# EAGLE design LPC1115_2TE_V1.04_I2C (EAGLE 7.2.0)
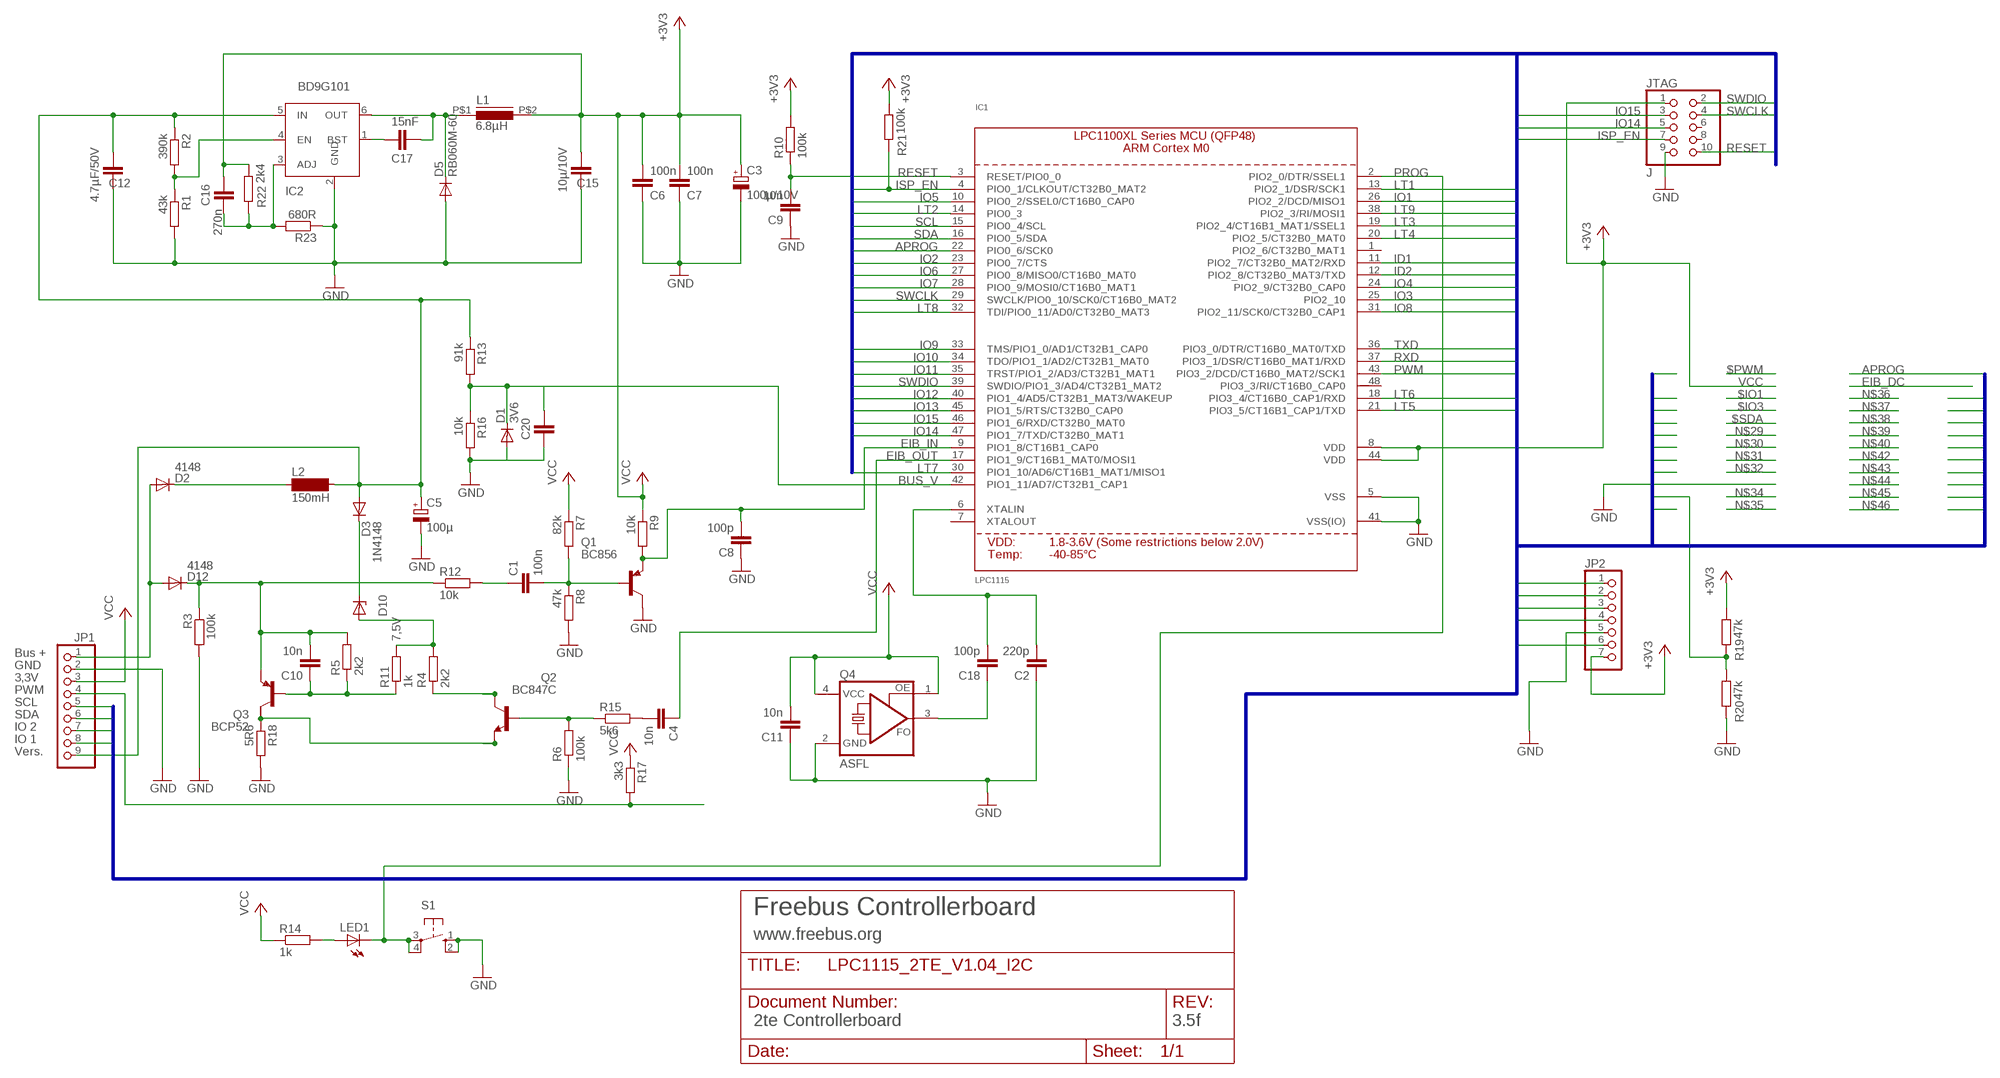
[diagram p0: schematic, sheet 1]

## Parts
C1  100n  C-EUC1206  [C1206]
C2  220p  C-EUC1206  [C1206]
C3  100µ/10V  CPOL-EUE2.5-5  [E2,5-5]
C4  10n  C-EUC1206  [C1206]
C5  100µ  CPOL-EUE3.5-8  [E3,5-8]
C6  100n  C-EUC1206  [C1206]
C7  100n  C-EUC1206  [C1206]
C8  100p  C-EUC1206K  [C1206K]
C9  10n  C-EUC1206K  [C1206K]
C10  10n  C-EUC1206  [C1206]
C11  10n  C-EUC1206  [C1206]
C12  4.7µF/50V  C-EUC1206K  [C1206K]
C15  10µ/10V  C-EUC1206K  [C1206K]
C16  270n  C-EUC1206  [C1206]
C17  15nF  C-EUC1206  [C1206]
C18  100p  C-EUC1206  [C1206]
C20  C-EUC1206  [C1206]
D1  3V6  DIODE-MINIMELF  [MINIMELF]
D2  4148  DIODE-MINIMELF  [MINIMELF]
D3  1N4148  DIODE-MINIMELF  [MINIMELF]
D5  RB060M-60  DIODE-SOD123  [SOD123]
D10  7,5V  ZPD  [MINIMELF]
D12  4148  DIODE-MINIMELF  [MINIMELF]
IC1  LPC1115  LPC1113/4/5_QFP48_XLSERIES  [LQFP48]
IC2  BD9G101  BD9G101GBD9G101G-SOT23-6  [SOT23-6]
JP1  PINHD-1X9  [1X09]
JP2  PINHD-1X7  [1X07]
JTAG  J  PINHD-2X05_2.00  [2X05M]
L1  6.8µH  IND_FASTRON_1616FPS  [PIS2812]
L2  150mH  BS11  [BS11]
LED1  LED3MM  [LED3MM]
Q1  BC856  BC856BSMD  [SOT23-BEC]
Q2  BC847C  BC847CSMD  [SOT23]
Q3  BCP52  FZT753SMD  [SOT223]
Q4  ASFL  [ASF]
R1  43k  R-EU_R1206  [R1206]
R2  390k  R-EU_R1206  [R1206]
R3  100k  R-EU_R1206  [R1206]
R4  2k2  R-EU_R1206  [R1206]
R5  2k2  R-EU_R1206  [R1206]
R6  100k  R-EU_R1206  [R1206]
R7  82k  R-EU_R1206  [R1206]
R8  47k  R-EU_R1206  [R1206]
R9  10k  R-EU_R1206  [R1206]
R10  100k  R-EU_R1206  [R1206]
R11  1k  R-EU_R1206  [R1206]
R12  10k  R-EU_R1206  [R1206]
R13  91k  R-EU_R1206  [R1206]
R14  1k  R-EU_R1206  [R1206]
R15  5k6  R-EU_R1206  [R1206]
R16  10k  R-EU_R1206  [R1206]
R17  3k3  R-EU_R1206  [R1206]
R18  5R6  R-EU_R1206  [R1206]
R19  47k  R-EU_R1206  [R1206]
R20  47k  R-EU_R1206  [R1206]
R21  100k  R-EU_R1206  [R1206]
R22  2k4  R-EU_R1206  [R1206]
R23  680R  R-EU_R1206  [R1206]
S1  10-XX  [B3F-10XX]

## Nets
APROG: IC1.22(PIO0_6/SCK0) JP1.8
BASE: C1.2 Q1.B R7.2 R8.1
BASE_SEND: Q2.1(B) R6.2 R15.1
BUS_V: C20.2 D1.C IC1.42(PIO1_11/AD7/CT32B1_CAP1) R13.2 R16.1
EIB+: D2.A D12.A JP1.1
EIB_DC: C5.+ C12.2 D3.A IC2.5(IN) JP1.9 L2.2 R2.1 R13.1
EIB_IN: C8.2 IC1.9(PIO1_8/CT16B1_CAP0) Q1.E R9.2
EIB_OUT: C4.1 IC1.17(PIO1_9/CT16B1_MAT0/MOSI1)
GND: C2.1 C3.- C5.- C6.1 C7.1 C8.1 C9.1 C11.1 C12.1 C15.1 C20.1 D1.A D5.A IC1.5(VSS) IC1.41(VSS(IO)) IC2.2(GND) JP1.2 JP2.5 JTAG.9 Q1.C Q4.2(GND) R1.2 R3.2 R6.1 R8.2 R16.2 R18.2 R20.1 R23.1 S1.1(S) S1.2(S1)
I_SENSE: Q2.2(E) Q3.2(C) R18.1
ID1: IC1.11(PIO2_7/CT32B0_MAT2/RXD)
ID2: IC1.12(PIO2_8/CT32B0_MAT3/TXD)
IO1: IC1.26(PIO2_2/DCD/MISO1)
IO2: IC1.23(PIO0_7/CTS)
IO3: IC1.25(PIO2_10)
IO4: IC1.24(PIO2_9/CT32B0_CAP0)
IO5: IC1.10(PIO0_2/SSEL0/CT16B0_CAP0)
IO6: IC1.27(PIO0_8/MISO0/CT16B0_MAT0) JP1.7
IO7: IC1.28(PIO0_9/MOSI0/CT16B0_MAT1)
IO8: IC1.31(PIO2_11/SCK0/CT32B0_CAP1)
IO9: IC1.33(TMS/PIO1_0/AD1/CT32B1_CAP0)
IO10: IC1.34(TDO/PIO1_1/AD2/CT32B1_MAT0)
IO11: IC1.35(TRST/PIO1_2/AD3/CT32B1_MAT1)
IO12: IC1.40(PIO1_4/AD5/CT32B1_MAT3/WAKEUP) R19.1 R20.2
IO13: IC1.45(PIO1_5/RTS/CT32B0_CAP0)
IO14: IC1.47(PIO1_7/TXD/CT32B0_MAT1) JTAG.5
IO15: IC1.46(PIO1_6/RXD/CT32B0_MAT0) JTAG.3
ISP_EN: IC1.4(PIO0_1/CLKOUT/CT32B0_MAT2) JTAG.7 R21.1
LT1: IC1.13(PIO2_1/DSR/SCK1) JP2.1
LT2: IC1.14(PIO0_3)
LT3: IC1.19(PIO2_4/CT16B1_MAT1/SSEL1) JP2.6
LT4: IC1.20(PIO2_5/CT32B0_MAT0)
LT5: IC1.21(PIO3_5/CT16B1_CAP1/TXD)
LT6: IC1.18(PIO3_4/CT16B0_CAP1/RXD) JP2.2
LT7: IC1.30(PIO1_10/AD6/CT16B1_MAT1/MISO1) JP2.3
LT8: IC1.32(TDI/PIO0_11/AD0/CT32B0_MAT3)
LT9: IC1.38(PIO2_3/RI/MOSI1) JP2.4
LX: C17.1 D5.C IC2.6(OUT) L1.P$1
N$1: Q2.3(C) R4.1
N$2: C2.2 C18.2 IC1.6(XTALIN)
N$4: C10.2 D12.C Q3.3(E) R3.1 R5.2 R12.1
N$7: C18.1 Q4.3(FO)
N$9: LED1.A R14.2
N$13: D2.C L2.1
N$15: D3.C D10.C
N$16: C1.1 R12.2
N$17: C4.2 R15.2
N$19: C17.2 IC2.1(BST)
N$20: IC2.4(EN) R1.1 R2.2
N$24: C16.1 IC2.3(ADJ) R22.1 R23.2
N$28: C10.1 Q3.1(B) R5.1 R11.1
PROG: IC1.2(PIO2_0/DTR/SSEL1) LED1.K(C) S1.3(P) S1.4(P1)
PWM: IC1.43(PIO3_2/DCD/CT16B0_MAT2/SCK1) JP1.4 R17.2
REFERENZ: D10.A R4.2 R11.2
RESET: C9.2 IC1.3(RESET/PIO0_0) JTAG.10 R10.1
RXD: IC1.37(PIO3_1/DSR/CT16B0_MAT1/RXD)
SCL: IC1.15(PIO0_4/SCL) JP1.5
SDA: IC1.16(PIO0_5/SDA) JP1.6
SWCLK: IC1.29(SWCLK/PIO0_10/SCK0/CT16B0_MAT2) JTAG.4
SWDIO: IC1.39(SWDIO/PIO1_3/AD4/CT32B1_MAT2) JTAG.2
TXD: IC1.36(PIO3_0/DTR/CT16B0_MAT0/TXD)
VCC: C3.+ C6.2 C7.2 C11.2 C15.2 C16.2 IC1.8(VDD) IC1.44(VDD) JP1.3 JP2.7 JTAG.1 L1.P$2 Q4.1(OE) Q4.4(VCC) R7.1 R9.1 R10.2 R14.1 R17.1 R19.2 R21.2 R22.2 ; supply symbol labelled +3V3
Unconnected: IC1.1(PIO2_6/CT32B0_MAT1) IC1.7(XTALOUT) IC1.48(PIO3_3/RI/CT16B0_CAP0) JTAG.6 JTAG.8 Q3.4(C/)

## Buses
IO[1..15],LT[1..9],SCL,SDA,PWM,APROG,RXD,TXD,RESET,SWCLK,SWDIO,ISP_EN,ID1,ID2

## Notes on the sheet
- D8 mit SMAJ40C bestücken
  wenn Controller ohne App
  Platine verwendet wird.
- C1 kann entfallen wenn die
  App wenig Strom braucht
- Die Schutzwiderstände R24..R55
  vor SV1 und SV2 sind optional und
  sollten nur bei Bedarf bestückt werden.
- Power LED (LED4+R20)
  ist optional
- Bus +
- GND
- 3,3V
- PWM
- SCL
- SDA
- IO 2
- IO 1
- Vers.
- Freebus Controllerboard
- www.freebus.org
- 2te Controllerboard | 3.5f

## Library data of the parts
C1 C2 C4 C6-C12 C15-C18 C20 = rcl:C-EU: CAPACITOR, European symbol
C3 C5 = rcl:CPOL-EU: POLARIZED CAPACITOR, European symbol
D1-D3 D5 D12 = diode:DIODE-: DIODE
D10 = diode:ZPD: Z DIODE 500 mW
IC1 = microbuilder:LPC1113/4/5_QFP48_XLSERIES: LPC1113/4/5 ARM Cortex M0 MCU (50MHz) - XL Series (FBD48/3x3) LPC1115FBD48/303: Max Frequency: 50MHz Flash: 64kB SRAM: 8kB ADC: 10-bit
IC2 = Stefan_selfbus:BD9G101G
JP1 = pinhead:PINHD-1X9: PIN HEADER
JP2 = pinhead:PINHD-1X7: PIN HEADER
JTAG = pinhead-2:PINHD-2X05: PIN HEADER
L1 = Stefan_selfbus:IND_FASTRON_1616FPS
L2 = inductor-neosid:BS: INDUCTOR nominal inductance, magnetically screened
LED1 = led:LED: LED OSRAM: - CHIPLED LG R971, LG N971, LY N971, LG Q971, LY Q971, LO R971, LY R971 LH N974, LH R974 LS Q976, LO Q976, LY Q976 LO Q996 - Hyper CHIPLED LW Q18S LB Q993, LB Q99A, LB R99A - SideLED LS A670, LO A670, LY A670, LG A670, LP A670 LB A673, LV A673, LT A673, LW A673 LH A674 LY A675 LS A676, LA A676, LO A676, LY A676, LW A676 LS A679, LY A679, LG A679 - Hyper Micro SIDELED® LS Y876, LA Y876, LO Y876, LY Y876 LT Y87S - SmartLED LW L88C, LW L88S LB L89C, LB L89S, LG L890 LS L89K, LO L89K, LY L89K LS L896, LA L896, LO L896, LY L896 - TOPLED LS T670, LO T670, LY T670, LG T670, LP T670 LSG T670, LSP T670, LSY T670, LOP T670, LYG T670 LG T671, LOG T671, LSG T671 LB T673, LV T673, LT T673, LW T673 LH T674 LS T676, LA T676, LO T676, LY T676, LB T676, LH T676, LSB T676, LW T676 LB T67C, LV T67C, LT T67C, LS T67K, LO T67K, LY T67K, LW E67C LS E67B, LA E67B, LO E67B, LY E67B, LB E67C, LV E67C, LT E67C LW T67C LS T679, LY T679, LG T679 LS T770, LO T770, LY T770, LG T770, LP T770 LB T773, LV T773, LT T773, LW T773 LH T774 LS E675, LA E675, LY E675, LS T675 LS T776, LA T776, LO T776, LY T776, LB T776 LHGB T686 LT T68C, LB T68C - Hyper Mini TOPLED® LB M676 - Mini TOPLED Santana® LG M470 LS M47K, LO M47K, LY M47K Source: http://www.osram.convergy.de - LUMILED® LXK2-PW12-R00, LXK2-PW12-S00, LXK2-PW14-U00, LXK2-PW14-V00 LXK2-PM12-R00, LXK2-PM12-S00, LXK2-PM14-U00 LXK2-PE12-Q00, LXK2-PE12-R00, LXK2-PE12-S00, LXK2-PE14-T00, LXK2-PE14-U00 LXK2-PB12-K00, LXK2-PB12-L00, LXK2-PB12-M00, LXK2-PB14-N00, LXK2-PB14-P00, LXK2-PB14-Q00 LXK2-PR12-L00, LXK2-PR12-M00, LXK2-PR14-Q00, LXK2-PR14-R00 LXK2-PD12-Q00, LXK2-PD12-R00, LXK2-PD12-S00 LXK2-PH12-R00, LXK2-PH12-S00 LXK2-PL12-P00, LXK2-PL12-Q00, LXK2-PL12-R00 Source: www.luxeon.com
Q1 = transistor-pnp:BC856*: PNP Transistror
Q2 = transistor-npn:BC847*: NPN Transistor
Q3 = transistor-pnp:FZT753SMD: PNP Transistor
Q4 = crystal:ASF*: CRYSTAL CLOCK OSCILLATORS 5.0 Vdc or 3.3 Vdc - LOW PROFILE ULTRA MINIATURE CERAMIC SURFACE MOUNT Source: http://www.abracon.com/Oscillators/asf1-L-L1.pdf; MPN: ASFLM1-50.000MHZ-C-T; OC_FARNELL: 1838931; OC_NEWARK: 99M0411
R1-R23 = rcl:R-EU_: RESISTOR, European symbol
S1 = switch-omron:10-XX: OMRON SWITCH

## Board
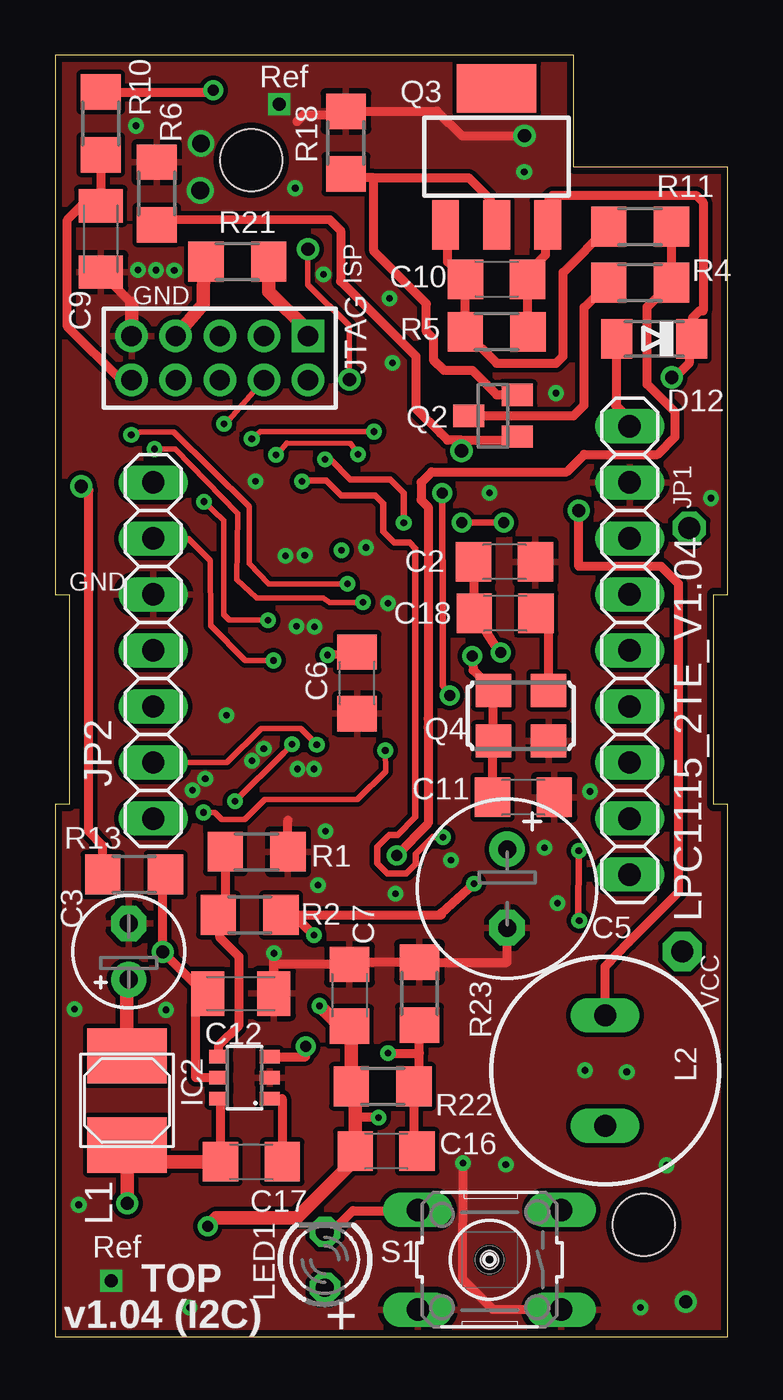
[diagram p1: board, top side]
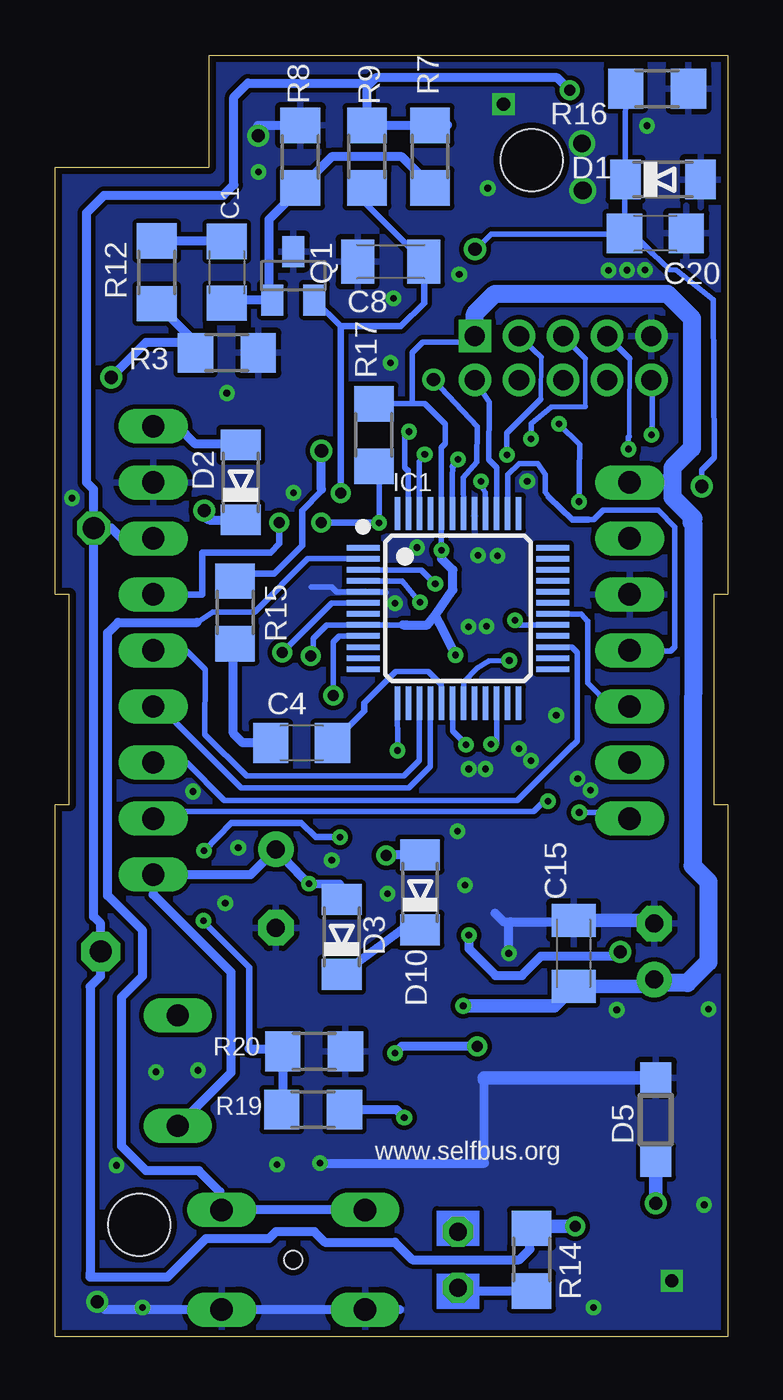
[diagram p2: board, bottom side, seen from below]

Size 30.48 x 58.1 mm. Coordinates in mm from the lower left corner, seen from the top.
Outline: 0,0 30.48,0 30.48,24.13 29.85,24.13 29.85,33.65 30.48,33.65 30.48,53.02 23.5,53.02 23.5,58.1 0,58.1 0,33.65 0.64,33.65 0.64,24.13 0,24.13 0,0
Copper layers (1*16): Top 0.035mm / dielectric 1.5mm / Bottom 0.035mm
Design rules "default *": minimum track width 8mil, minimum drill 0.3mm, track to track 8mil, track to pad 8mil, pad to pad 8mil, via to via 8mil, smd to smd 8mil, copper to edge 12mil, drill to drill 8mil, minimum pad ring 11mil, minimum via ring 8mil, stop-mask expansion 4mil, vias tented up to drill 12mil, thermal gap 10mil
Holes 2.8 mm at 26.67,5.08 8.89,53.34
Holes 0.8 mm at 19.69,3.49

### Footprints (pad centres in the part's own frame; a part is rotated, then mirrored left to right if it is on the bottom)
C1206 = smd 1.6 x 1.8: 1 -1.4,0; 2 1.4,0
E2,5-5 = drill 0.813 pad 1.6: + -1.27,0 | drill 0.813 pad 1.6 octagon: - 1.27,0
E3,5-8 = drill 0.813 pad 1.6: + -1.778,0 | drill 0.813 pad 1.6 octagon: - 1.778,0
C1206K = smd 1.5 x 2: 1 -1.5,0; 2 1.5,0
MINIMELF = smd 1.4 x 1.8: A 1.7,0; C -1.7,0
SOD123 = smd 1.4 x 1.4: A 1.9,0; C -1.9,0
LQFP48 = smd 1.5 x 0.25: 1 -4.3,2.75; 2 -4.3,2.25; 3 -4.3,1.75; 4 -4.3,1.25; 5 -4.3,0.75; 6 -4.3,0.25; 7 -4.3,-0.25; 8 -4.3,-0.75; 9 -4.3,-1.25; 10 -4.3,-1.75; 11 -4.3,-2.25; 12 -4.3,-2.75; 25 4.3,-2.75; 26 4.3,-2.25; 27 4.3,-1.75; 28 4.3,-1.25; 29 4.3,-0.75; 30 4.3,-0.25; 31 4.3,0.25; 32 4.3,0.75; 33 4.3,1.25; 34 4.3,1.75; 35 4.3,2.25; 36 4.3,2.75 | smd 0.25 x 1.5: 13 -2.75,-4.3; 14 -2.25,-4.3; 15 -1.75,-4.3; 16 -1.25,-4.3; 17 -0.75,-4.3; 18 -0.25,-4.3; 19 0.25,-4.3; 20 0.75,-4.3; 21 1.25,-4.3; 22 1.75,-4.3; 23 2.25,-4.3; 24 2.75,-4.3; 37 2.75,4.3; 38 2.25,4.3; 39 1.75,4.3; 40 1.25,4.3; 41 0.75,4.3; 42 0.25,4.3; 43 -0.25,4.3; 44 -0.75,4.3; 45 -1.25,4.3; 46 -1.75,4.3; 47 -2.25,4.3; 48 -2.75,4.3
SOT23-6 = smd 0.6 x 0.9: 1 -0.95,-1.15; 2 0,-1.15; 3 0.95,-1.15; 4 0.95,1.15; 5 0,1.15; 6 -0.95,1.15
1X09 = drill 1.016 long: 1 -10.16,0; 2 -7.62,0; 3 -5.08,0; 4 -2.54,0; 5 0,0; 6 2.54,0; 7 5.08,0; 8 7.62,0; 9 10.16,0
1X07 = drill 1.016 long: 1 -7.62,0; 2 -5.08,0; 3 -2.54,0; 4 0,0; 5 2.54,0; 6 5.08,0; 7 7.62,0
2X05M = drill 0.914 square: 1 -4,-1 | drill 0.914: 2 -4,1; 3 -2,-1; 4 -2,1; 5 0,-1; 6 0,1; 7 2,-1; 8 2,1; 9 4,-1; 10 4,1
PIS2812 = smd 3.6 x 2.5: P$1 0,2.025; P$2 0,-2.025
BS11 = drill 1 long: 1 -2.5,0; 2 2.5,0
LED3MM = drill 0.813 octagon: A -1.27,0; K 1.27,0
SOT23-BEC = smd 1 x 1.4: B -0.95,-1.1; C 0,1.1; E 0.95,-1.1
SOT23 = smd 1 x 1.4: 1 -0.95,-1.1; 2 0.95,-1.1; 3 0,1.1
SOT223 = smd 1.219 x 2.235: 1 -2.311,-3.099; 2 0,-3.099; 3 2.311,-3.099 | smd 3.6 x 2.2: 4 0,3.099
ASF = smd 1.6 x 1.5: 1 -1.25,-1.15; 2 1.25,-1.15; 3 1.25,1.15; 4 -1.25,1.15
R1206 = smd 1.6 x 1.803: 1 -1.422,0; 2 1.422,0
B3F-10XX = drill 1.016 long: 1 -3.251,2.261; 2 3.251,2.261; 3 -3.251,-2.261; 4 3.251,-2.261

### Placement (x,y rotation side)
C1  22.7,48.26 270 bottom
C2  20.36,35.13 180 top
C3  3.33,17.46 90 top
C4  19.31,26.92 180 bottom
C5  20.48,20.32 270 top
C6  13.68,29.65 90 top
C7  13.34,15.48 270 top
C8  15.27,48.74 0 bottom
C9  2.06,49.77 90 top
C10  20,47.94 0 top
C11  21.22,24.46 180 top
C12  8.41,15.56 180 top
C15  6.99,17.38 270 bottom
C16  15,8.41 180 top
C17  8.89,7.94 0 top
C18  20.4,32.8 180 top
C20  3.28,50.03 180 bottom
D1  2.93,52.46 0 bottom
D2  22.07,38.73 90 bottom
D3  17.49,18.13 90 bottom
D5  3.25,9.84 90 bottom
D10  13.94,20.15 90 bottom
D12  27.15,45.24 180 top
IC1  12.22,33.02 0 bottom
IC2  8.57,11.75 90 top
JP1  26.04,31.12 270 top
JP2  4.45,31.12 90 top
JTAG  7.46,44.37 180 top
L1  3.25,10.72 180 top
L2  24.92,12.06 270 top
LED1  12.22,3.49 90 top
Q1  19.69,48.1 0 bottom
Q2  19.84,41.75 90 top
Q3  20,53.5 0 top
Q4  21.11,28.16 0 top
R1  9.13,21.99 0 top
R2  8.81,19.13 180 top
R3  22.7,44.61 0 bottom
R4  26.51,47.78 0 top
R5  20,45.56 0 top
R6  4.6,51.83 270 top
R7  13.49,53.5 270 bottom
R8  19.37,53.5 90 bottom
R9  16.35,53.5 270 bottom
R10  2.06,55.01 90 top
R11  26.51,50.32 0 top
R12  25.88,48.26 90 bottom
R13  3.58,20.95 180 top
R14  8.89,3.49 270 bottom
R15  22.33,32.84 270 bottom
R16  3.2,56.58 0 bottom
R17  16.03,40.88 270 bottom
R18  13.18,54.13 90 top
R19  18.79,10.3 0 bottom
R20  18.75,12.94 180 bottom
R21  8.26,48.74 0 top
R22  14.84,11.35 180 top
R23  16.51,15.56 270 top
S1  19.69,3.49 180 top

### Tracks (layer width: path | path; a pad name or v marks a point on that pad's centre or on a via)
APROG  (via drill 0.3)
  Top 0.254: v8.15,24.27 10.36,26.46 v10.73,26.86
  Bottom 0.254: JP1.8 25.72,23.81 8.78,23.81 8.18,24.42 v8.15,24.27 | v10.73,26.86 10.47,26.9 IC1.22
BASE
  Bottom 0.406: R7.2 13.97,52.7 14.76,53.5 17.95,53.5 R8.1 20.8,50.65 20.8,47.16 Q1.B 22.88,47 C1.2
BASE_SEND  (via drill 0.6)
  Top 0.406: 18.42,40.64 20.31,40.64 Q2.1 | v18.42,40.16 18.42,40.64 | 18.42,40.64 17.78,40.64 17.46,40.96 | 17.46,40.96 | 17.46,40.96 16.35,42.07 16.35,44.45 12.94,47.85 12.94,50.15 12.47,50.63 4.84,50.64 R6.2
  Bottom 0.305: 18.42,38.42 18.42,38.34 19.29,37.46 19.29,35.88 20.56,34.61 21.98,34.61 R15.1
  Bottom 0.406: 18.42,38.42 v18.42,40.16
BUS_V  (via drill 0.6)
  Top 0.254: v13.34,43.4 13.34,45.83 11.46,47.7 v11.46,49.3 | 1.52,38.38 1.32,38.38 v1.18,38.56
  Top 0.406: R13.2 2.16,22.26 1.52,22.9 1.52,38.38
  Bottom 0.254: IC1.42 11.98,38.95 11.36,39.65 11.35,41.26 v13.34,43.4 | v11.46,49.3 11.43,49.26 10.71,49.99 4.72,49.99 C20.2 | C20.2 4.68,52.42 D1.C 4.63,54.62 R16.1 | v1.18,38.56 1.18,39.28 0.61,39.85 0.65,47.01 2.32,48.35 2.63,48.39 3.39,49.11 4.5,50.19 C20.2
EIB+
  Top 0.406: JP1.1 26.04,41.59 25.4,42.23 25.45,42.27 D12.A
  Bottom 0.406: JP1.1 24.92,41.27 24.13,40.48 22.11,40.48 D2.A
EIB_DC  (via drill 0.3, 0.6)
  Top 0.406: R13.1 4.88,20.83 v4.88,17.45 6.57,15.76 6.91,15.76 C12.2 6.36,15.01 6.36,11.77 6.39,11.75 IC2.5 | v11.74,18.21 10.78,19.13 R2.1 17.51,19.13 17.51,19.22 v18.97,20.54
  Bottom 0.406: C5.+ 21.62,20.95 JP1.9 26.04,20.05 22.52,16.53 22.52,11.97 L2.2 | C5.+ 20.46,22.1 | v11.74,18.21 11.74,17.6 10.52,16.38 9.34,16.38 8.46,17.26 5.07,17.26 v4.88,17.45 | C5.+ 19.3,20.84 v18.97,20.54 17.6,20.51 D3.A
EIB_IN  (via drill 0.5)
  Top 0.305: v17.87,29.07 17.57,29.51 17.57,34.92 17.54,35.56 v17.54,38.26
  Bottom 0.254: IC1.9 17.6,31.77 17.87,31.49 17.87,30.92 v17.87,29.07
  Bottom 0.305: R9.2 | v17.54,38.26 17.54,45.81 | 17.54,45.81 Q1.E | R9.2 16.35,51.32 C8.2 13.75,48.72 13.75,46.86 14.81,45.81 17.54,45.81
EIB_OUT
  Bottom 0.254: IC1.17 12.97,29.56 13.57,30.16 15.04,30.16 16.47,28.73
  Bottom 0.305: 16.47,28.73 16.47,28.37 C4.1
GND  (via drill 0.3, 0.6, 0.8)
  Top 0.406: v21.27,54.45 18.42,54.45 17.3,55.56 R18.2 13.18,55.4 11.27,55.4 | v18.48,7.87 18.49,7.78 18.48,2.6 19.84,1.23 S1.1 | C5.- | 11.27,55.4 | 11.27,55.4 10.95,55.09 | C5.- 20.48,16.98 R23.1 13.34,16.98 C7.1 9.91,16.88 C12.1 v9.91,17.37 v9.92,17.38 | R1.2 10.55,23.41 | 3.46,46.86 3.46,46.87 C9.1
  Top 0.61: JP1.2 | JP1.2 24.77,38.73 | JTAG.9 3.46,46.86
  Bottom 0.254: 15.48,33.73 15.51,33.77 IC1.5 17.73,33.77 17.95,33.98 18.87,33.98
  Bottom 0.406: 21.59,1.23 S1.1 28.22,1.23 v28.58,1.59 | 21.59,1.23 S1.2 14.88,1.23 | 21.59,1.23 21.59,1.27 | 21.28,44.29 R3.2 | R8.2 21.28,54.92 v21.27,54.45 | v18.48,7.87 11.03,7.87 11.03,11.67 | 10.56,19.21 10.16,18.81 9.84,18.81 | 9.84,18.81 7.06,18.81 C15.1 | v9.92,17.38 9.92,18.73 9.84,18.81 | JP1.2
  Bottom 0.61: C15.1 3.33,18.88 C3.- | D5.A 11.03,11.74 11.03,11.67
  other vias: 11.91,20.48 15.08,33.26 10.88,52.07 11.74,25.74 10.98,25.74 22.7,42.78 19.69,38.26 24.24,24.72 15.15,47.08 6.22,24.78 6.61,54.1 6.57,51.97 3.66,54.91 15.28,44.15 17.95,21.6 22.18,22.17 22.77,19.65 15.42,20.08 2.54,2.54 10.16,55.88 29.72,38.02 21.26,52.81 27.7,7.77 26.52,1.33 6.08,1.32 1.07,5.98 0.88,14.86 5.03,14.82 20.42,7.81 24,12.08 3.75,48.36 12.17,48.15 4.57,48.35 5.4,48.34 12.24,22.93 9.09,38.78 25.9,12.01 6.8,25.3 7.77,28.18 10.94,32.21 11.75,32.18 10.43,35.41 11.31,35.42 14.09,35.78 8.92,26.11 9.45,26.66
  pour Bottom: 0,58.1 23.5,58.1 23.5,53.02 30.48,53.02 30.48,33.65 29.85,33.65 29.85,24.13 30.48,24.13 30.48,0 0,0 0,24.13 0.64,24.13 0.64,33.65 0,33.65
  pour Top: 0,58.1 23.5,58.1 23.5,53.02 30.48,53.02 30.48,33.65 29.85,33.65 29.85,24.13 30.48,24.13 30.48,0 0,0 0,24.13 0.64,24.13 0.64,33.65 0,33.65
I_SENSE
  Top 0.406: Q3.2 19.69,51.59 18.73,52.55 14.45,52.55 | Q2.2 20,42.7 18.89,43.81 17.62,43.81 17.15,44.29 17.15,45.24 16.83,45.56 16.83,46.83 14.45,49.21 14.45,52.55 | 14.45,52.55 | 14.45,52.55 13.34,52.55 R18.1
IO6
  Bottom 0.254: JP1.7 24.53,26.03 22.81,24.32 9.54,24.32 7.02,26.84 7.01,26.84 6.83,27.02 6.82,31.03 7.07,31.28 IC1.27
IO12  (via drill 0.3)
  Top 0.305: v11.18,38.79 11.21,38.82 12.28,38.82 12.96,38.14 14.51,38.14 14.87,37.78 14.87,36.51 15.37,36.01 16.06,36.01 16.32,35.74 16.32,23.56 15.53,22.76 15.15,22.76 14.59,22.2 14.59,21.45 15.04,21 15.92,21 16.35,21.43 16.35,21.89 17.11,22.65 v17.57,22.65 | v23.73,22.03 23.71,18.91 v23.75,18.87
  Bottom 0.254: IC1.40 10.98,38.18 11,38.27 11.08,38.44 v11.18,38.79
  Bottom 0.305: v17.57,22.65 18.68,22.65 19.32,23.29 22.5,23.29 v23.73,22.03 | v23.75,18.87 23.75,18.8 21.69,16.74 21.69,13.06
  Bottom 0.406: 21.69,13.06 20.29,13.06 R20.2 20.17,10.35 R19.1
IO14  (via drill 0.3)
  Top 0.254: v14.45,41.04 9.3,41.04 v8.91,40.7
  Bottom 0.203: 6.47,42.17 6.47,44.34
  Bottom 0.254: IC1.47 14.48,39.28 14.52,39.28 14.63,39.39 14.63,40.85 v14.45,41.04 | v8.91,40.7 8.91,41.4 8,42.16 6.47,42.17 | 6.47,44.34 JTAG.5
IO15  (via drill 0.3)
  Top 0.254: v13.73,40 13.4,40.5 10.5,40.5 10.04,39.96 v10.01,39.99
  Bottom 0.203: 8.48,42.51 8.46,44.4
  Bottom 0.254: IC1.46 13.97,39.68 v13.73,40 | v10.01,39.99 10.02,40.97 8.48,42.51 | 8.46,44.4 JTAG.3
ISP_EN  (via drill 0.3)
  Top 0.254: v13.95,33.3 12.44,33.29 12.14,33.5 9.13,33.5 8.22,34.32 8.27,37.33 5.43,40.23 v4.51,40.24
  Top 0.61: JTAG.7 6.7,46.82 6.71,47.42 6.75,48.66 R21.1
  Bottom 0.203: 4.47,40.82 4.46,41.6 4.45,44.35
  Bottom 0.254: IC1.4 14.74,34.27 v13.95,33.3 | 4.45,44.35 JTAG.7 | 4.47,40.82 4.51,40.79 v4.51,40.24
LT1  (via drill 0.3)
  Top 0.254: v6.73,23.77 7.23,23.77 7.55,23.45 8.6,23.45 9.5,24.35 13.7,24.35 14.97,25.62 v14.96,26.58
  Bottom 0.254: v6.73,23.77 4.72,23.77 JP2.1 | v14.96,26.58 IC1.13
LT3  (via drill 0.3)
  Top 0.254: v9.9,30.66 8.62,30.66 7.04,32.24 7.03,35.18 6.04,36.18 4.46,36.18 JP2.6
  Bottom 0.254: IC1.19 11.97,29.68 11.35,30.32 10.84,30.64 v9.9,30.66
LT6  (via drill 0.3)
  Top 0.254: v11.85,26.85 11.12,27.58 9.34,27.58 7.78,26.03 7.06,26.03 6.99,26.03 JP2.2
  Bottom 0.254: IC1.18 12.46,28.71 12.45,27.46 v11.85,26.85
LT7
  Bottom 0.254: IC1.30 6.63,32.77 6.36,32.45 6.36,32.46 6.36,29.63 5.3,28.57 JP2.3
LT9
  Bottom 0.254: IC1.38 9.97,38.52 9.96,39.08 9.44,39.58 8.6,39.59 8.27,39.09 8.27,38.29 8.13,38.12 8.11,38.08 | 6.31,37.04 6.08,37.04 5.65,37.47 3.16,37.47 2.4,36.71 2.4,31.27 2.58,31.09 4.42,31.09 JP2.4
  Bottom 0.305: 8.11,38.08 7.05,37.04 6.31,37.04
LX  (via drill 0.6)
  Top 0.406: IC2.6 7.49,10.8 C17.1
  Top 0.61: L1.P$1 D5.C | D5.C C17.1 | v3.26,6.05 D5.C
  Bottom 0.61: D5.C 3.26,7.93 v3.26,6.05
N$1
  Top 0.406: Q2.3 23.5,41.75 23.97,42.23 23.97,46.66 R4.1
N$2  (via drill 0.5)
  Top 0.254: v20.19,31.01 20.04,31.19 | 18.96,32.84 C18.2
  Top 0.406: 20.04,31.19 C18.2 | C2.2 18.96,32.84
  Bottom 0.254: IC1.6 17.95,33.27 v20.19,31.01
N$4  (via drill 0.6)
  Top 0.406: Q3.3 22.07,50.33 | Q3.3 22.23,50.31 22.23,49.05 21.4,48.23 C10.2 21.43,47.92 R5.2 | Q3.3 22.38,50.47 22.38,51.59 22.54,51.75 29.05,51.75 29.37,51.43 29.37,46.51 29.21,46.51 28.89,46.2 28.89,45.29 D12.C 28.73,45.13 28.73,44.13 28.1,43.5 v27.94,43.5
  Bottom 0.406: 24.12,45.08 R3.1 | 24.12,45.08 R12.1 26.19,46.84 | 24.12,45.08 26.35,45.08 v27.94,43.5
N$7
  Top 0.254: 22.36,32.24 C18.1
  Top 0.406: Q4.3 22.36,32.24
N$9
  Bottom 0.406: R14.2 12.07,2.07 LED1.A
N$13  (via drill 0.6)
  Top 0.406: L2.1 24.92,14.72 24.92,15.56 24.92,16.79 26,17.9 28.1,20 | 28.1,20 | 28.1,20 28.26,20.16 28.26,34.13 27.46,34.92 23.74,34.92 v23.72,37.45
  Bottom 0.406: v23.72,37.45 23.61,37.09 23.5,37.03 D2.C
N$15
  Bottom 0.406: D10.C 14.76,18.45 D3.C
N$16
  Bottom 0.406: C1.1 25.85,49.66 R12.2
N$17
  Bottom 0.305: 22.4,31.34 R15.2
  Bottom 0.406: C4.2 21.97,26.92 22.4,27.36 22.4,31.34
N$19
  Top 0.406: IC2.1 10.29,10.8 C17.2
N$20
  Top 0.406: IC2.4 7.42,13.22 8.33,14.13 8.33,17.22 7.46,18.1 7.46,19.06 R2.2 7.71,19.45 R1.1
N$24  (via drill 0.3, 0.5)
  Top 0.406: C16.1 16.27,8.41 R22.1 16.51,11.35 16.51,12.86 | 16.51,12.86 R23.2 | IC2.3 11.35,12.7 v11.35,13.18 | v15.08,12.86 16.51,12.86
  Bottom 0.406: v11.35,13.18 14.76,13.18 v15.08,12.86
N$28
  Top 0.406: Q3.1 17.78,50.31 17.78,48.74 18.57,47.94 C10.1 18.58,47.92 R5.1 20,44.13 22.7,44.13 23.02,44.45 23.02,48.25 R11.1
PROG
  Top 0.406: LED1.K 12.54,4.76 13.49,5.71 16.19,5.71 16.23,5.75 S1.4
  Bottom 0.254: IC1.2 19.02,35.27 21.43,32.86 23.35,32.86 24.05,32.38
  Bottom 0.406: 24.05,32.38 27.62,32.38 28.1,31.91 28.1,20 26.51,18.41 26.51,16.35 27.46,15.4 27.46,8.64 26.35,7.53 23.97,7.53 23.02,6.57 23.05,6.47 23.02,5.75 | 15.52,5.75 15.88,5.71 15.96,5.8 S1.4 S1.3 23.02,5.75 | 23.02,5.75 23.02,5.71
PWM  (via drill 0.3, 0.5)
  Top 0.305: v20.32,36.91 v18.42,36.91 | v12.22,39.78 12.46,39.78 13.37,38.87 15.19,38.87 15.8,38.26 v15.8,36.91
  Bottom 0.254: IC1.43 12.47,38.97 12.47,39.45 | R17.2 15.8,39.22 v15.8,36.91
  Bottom 0.305: JP1.4 23.81,33.65 23.81,35.56 20.72,35.56 20.32,35.96 v20.32,36.91 | v18.42,36.91 v15.8,36.91 | v12.22,39.78 12.47,39.45
REFERENZ  (via drill 0.5)
  Top 0.406: 27.93,48.26 R11.2 | 27.93,48.26 R4.2 26.83,46.68 26.83,43.18 28.1,41.91 28.1,40.8 27.31,40 23.97,40 23.18,39.21 17.07,39.21 16.59,38.73 16.59,37.94 16.91,37.62 16.91,28.02 16.91,27.62 16.9,23.28 v15.48,21.83 | 27.93,48.26 27.93,48.25
  Bottom 0.406: D10.A 15.48,21.85 v15.48,21.83
RESET  (via drill 0.3)
  Top 0.254: v13.26,34.13 9.68,34.13 8.79,35.04 8.79,37.63 5.38,41.02 3.87,41.02 3.64,40.92 v3.45,40.9
  Top 0.406: R10.1 C9.2 1.19,51.28 0.56,50.64 0.56,45.8 2.98,43.37 JTAG.10
  Bottom 0.254: IC1.3 13.89,34.77 v13.26,34.13 | v3.45,40.9 3.44,41.23 3.42,41.14 3.41,43.32 JTAG.10
SCL
  Bottom 0.254: IC1.15 13.97,26.13 14.68,25.42 16.67,25.42 21.8,25.43 23.69,27.31 23.68,30.25 24.51,31.08 26,31.08 JP1.5
SDA
  Bottom 0.254: JP1.6 25.75,28.57 22.05,24.87 14.45,24.87 13.47,25.85 IC1.16
SWCLK  (via drill 0.3)
  Top 0.254: v6.74,37.86 7.64,37 7.65,32.73 7.9,32.49 v9.64,32.49 | JTAG.4 7.89,41.59 7.69,41.43 7.67,41.39 7.7,41.46 v7.66,41.39
  Bottom 0.254: v6.74,37.86 6.74,39.21 6.71,40.32 6.72,40.44 v7.66,41.39 | IC1.29 9.72,32.27 v9.64,32.49
SWDIO
  Bottom 0.254: IC1.39 10.47,39.41 10.82,39.76 10.82,42.38 JTAG.2
VCC  (via drill 0.3, 0.5, 1, 1 pad 1.78)
  Top 0.254: 19.82,26.97 Q4.1 | 11.46,45.61 JTAG.1
  Top 0.406: C6.2 13.44,30.93 v12.34,30.91 | R10.2 7.08,56.43 v7.16,56.51 | C11.2 19.82,26.97 | Q4.1 Q4.4 18.94,30.23 v18.9,30.86 | v14.66,9.94 13.6,9.94
  Top 0.61: L1.P$2 3.25,16.11 C3.+ | v11.99,15 12.91,14.08 C7.2 13.42,13.99 R22.2 13.6,11.17 13.6,9.94 C16.2 13.6,8.05 10.95,5.4 7.3,5.4 v6.91,5 | 11.46,45.61 9.68,47.39 R21.2
  Bottom 0.254: 14.71,32.27 16.47,32.27 16.48,32.26 IC1.8 18.17,32.27 18.78,31.66 18.78,31.01 v18.9,30.86 | 12.97,35.28 12.98,35.59 v12.97,35.65 IC1.44 12.98,37.36 12.99,39.09 12.98,40.31 12.79,40.5 12.8,41.38 13.73,42.3 14.29,42.3 | 14.29,42.3 R17.1 | JTAG.1 11.75,45.08 13.81,45.08 14.29,44.61 14.29,42.3
  Bottom 0.406: v28.73,36.67 27.94,36.67 27.46,36.19 JP1.3 | v28.73,36.67 28.73,33.81 28.73,33.5 28.73,19.05 28.42,18.73 28.42,18.26 v28.42,17.46 28.42,16.35 28.89,15.87 28.89,2.86 | v28.73,36.67 28.73,36.51 | v28.73,36.67 | 28.89,2.86 | 28.89,2.86 28.89,2.7 25.4,2.7 23.65,4.44 20.8,4.44 20.48,4.76 18.73,4.76 18.26,4.29 15.08,4.29 14.29,3.49 9.45,3.49 8.97,3.97 8.97,4.84 R14.1 | v28.73,36.67 28.73,38.42 29.05,38.73 29.05,50.96 28.26,51.75 22.86,51.75 22.38,52.23 22.38,56.2 21.75,56.83 16.51,56.83 16.35,56.67 | 16.35,56.67 R9.1 15.56,54.92 R7.1 12.7,54.93 | 14.71,32.27 14.57,32.27 13.62,32.27 13.25,32.72 | 13.25,32.72 12.45,33.87 12.46,34.77 12.97,35.28 | 16.35,56.67 15.95,57.07 7.72,57.07 v7.16,56.51 | v12.34,30.91 13.06,32.34 13.25,32.72 | R19.2 15.02,10.3 v14.66,9.94
  Bottom 0.61: C3.+ 3.64,15.88 C15.2 7.87,15 v11.99,15 | v6.91,5 8.8,5 R14.1 | JP2.7 4.39,38.79 2.52,38.79
  Bottom 0.813: JTAG.1 11.46,46.38 10.56,47.28 2.74,47.28 1.63,46.17 1.63,40.28 2.52,39.39 2.52,38.79 2.52,38.06 1.56,37.11 1.64,37.11 1.64,36.92 1.56,36.84 1.59,21.35 0.87,20.64 0.87,16.99 1.83,16.03 3.18,16.03 C3.+
(copper drawn outside any net)
  shapes: Bottom area x2

### Text on the board
tPlace: Ref | Ref | TOP | v1.04 (I2C) | +
tNames: ISP | GND | GND | LPC1115_2TE_V1.04 | VCC
bNames: www.selfbus.org